# EAGLE design R212X (EAGLE 6.6.0)
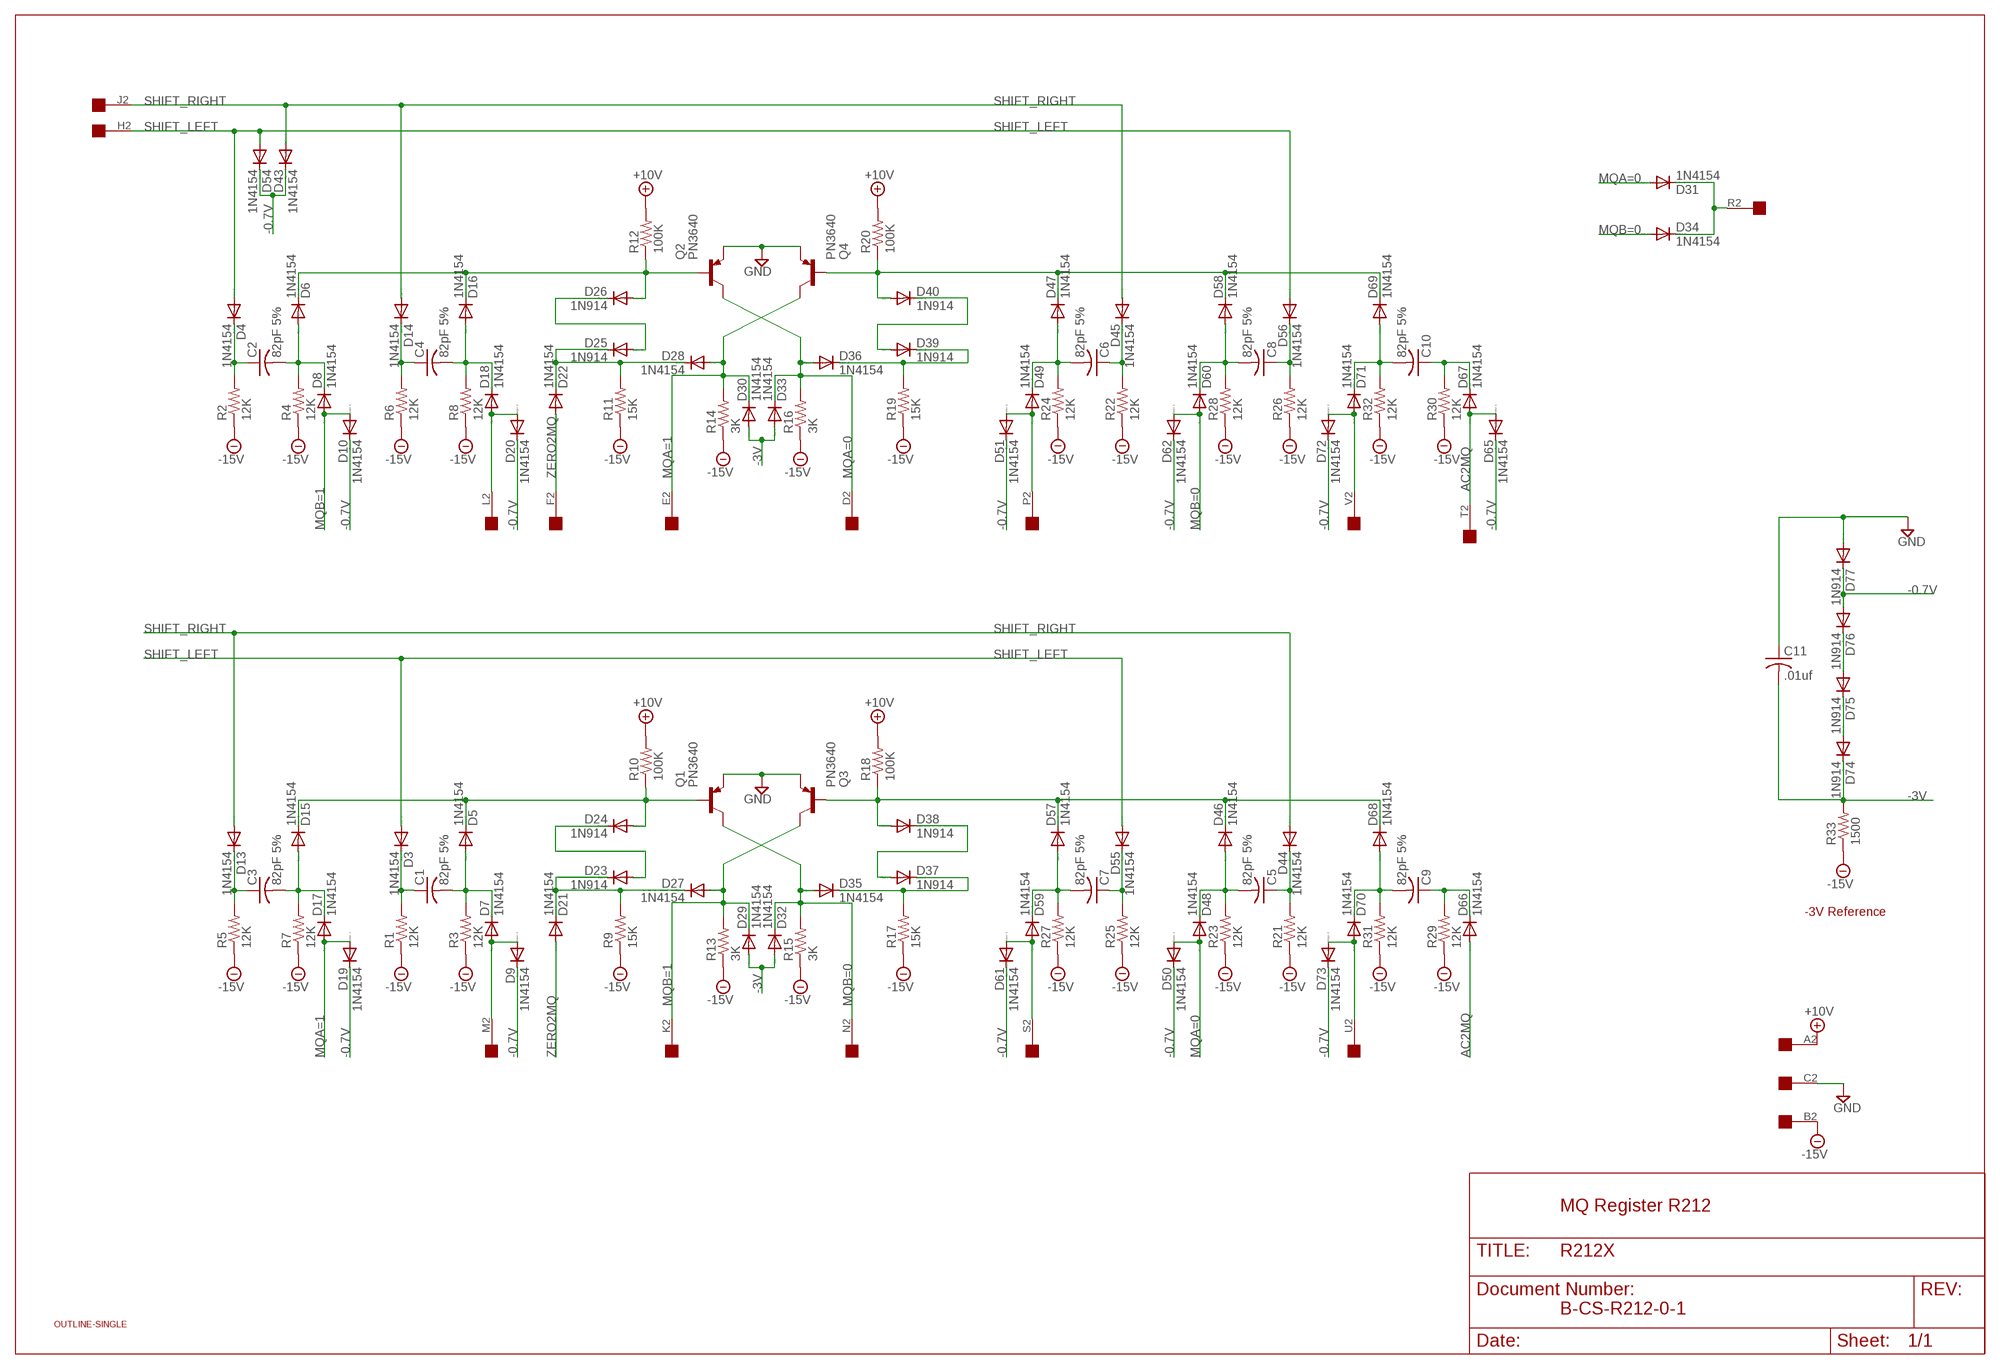
[diagram p0: schematic, sheet 1]

## Parts
C1  82pF 5%  C-US050-025X075  [C050-025X075]
C2  82pF 5%  C-US050-025X075  [C050-025X075]
C3  82pF 5%  C-US050-025X075  [C050-025X075]
C4  82pF 5%  C-US050-025X075  [C050-025X075]
C5  82pF 5%  C-US050-025X075  [C050-025X075]
C6  82pF 5%  C-US050-025X075  [C050-025X075]
C7  82pF 5%  C-US050-025X075  [C050-025X075]
C8  82pF 5%  C-US050-025X075  [C050-025X075]
C9  82pF 5%  C-US050-025X075  [C050-025X075]
C10  82pF 5%  C-US050-025X075  [C050-025X075]
C11  .01uf  C-US050-025X075  [C050-025X075]
D3  1N4154  1N4148DO35-10  [DO35-10]
D4  1N4154  1N4148DO35-10  [DO35-10]
D5  1N4154  1N4148DO35-10  [DO35-10]
D6  1N4154  1N4148DO35-10  [DO35-10]
D7  1N4154  1N4148DO35-10  [DO35-10]
D8  1N4154  1N4148DO35-10  [DO35-10]
D9  1N4154  1N4148DO35-10  [DO35-10]
D10  1N4154  1N4148DO35-10  [DO35-10]
D13  1N4154  1N4148DO35-10  [DO35-10]
D14  1N4154  1N4148DO35-10  [DO35-10]
D15  1N4154  1N4148DO35-10  [DO35-10]
D16  1N4154  1N4148DO35-10  [DO35-10]
D17  1N4154  1N4148DO35-10  [DO35-10]
D18  1N4154  1N4148DO35-10  [DO35-10]
D19  1N4154  1N4148DO35-10  [DO35-10]
D20  1N4154  1N4148DO35-10  [DO35-10]
D21  1N4154  1N4148DO35-10  [DO35-10]
D22  1N4154  1N4148DO35-10  [DO35-10]
D23  1N914  1N4148DO35-10  [DO35-10]
D24  1N914  1N4148DO35-10  [DO35-10]
D25  1N914  1N4148DO35-10  [DO35-10]
D26  1N914  1N4148DO35-10  [DO35-10]
D27  1N4154  1N4148DO35-10  [DO35-10]
D28  1N4154  1N4148DO35-10  [DO35-10]
D29  1N4154  1N4148DO35-10  [DO35-10]
D30  1N4154  1N4148DO35-10  [DO35-10]
D31  1N4154  1N4148DO35-10  [DO35-10]
D32  1N4154  1N4148DO35-10  [DO35-10]
D33  1N4154  1N4148DO35-10  [DO35-10]
D34  1N4154  1N4148DO35-10  [DO35-10]
D35  1N4154  1N4148DO35-10  [DO35-10]
D36  1N4154  1N4148DO35-10  [DO35-10]
D37  1N914  1N4148DO35-10  [DO35-10]
D38  1N914  1N4148DO35-10  [DO35-10]
D39  1N914  1N4148DO35-10  [DO35-10]
D40  1N914  1N4148DO35-10  [DO35-10]
D43  1N4154  1N4148DO35-10  [DO35-10]
D44  1N4154  1N4148DO35-10  [DO35-10]
D45  1N4154  1N4148DO35-10  [DO35-10]
D46  1N4154  1N4148DO35-10  [DO35-10]
D47  1N4154  1N4148DO35-10  [DO35-10]
D48  1N4154  1N4148DO35-10  [DO35-10]
D49  1N4154  1N4148DO35-10  [DO35-10]
D50  1N4154  1N4148DO35-10  [DO35-10]
D51  1N4154  1N4148DO35-10  [DO35-10]
D54  1N4154  1N4148DO35-10  [DO35-10]
D55  1N4154  1N4148DO35-10  [DO35-10]
D56  1N4154  1N4148DO35-10  [DO35-10]
D57  1N4154  1N4148DO35-10  [DO35-10]
D58  1N4154  1N4148DO35-10  [DO35-10]
D59  1N4154  1N4148DO35-10  [DO35-10]
D60  1N4154  1N4148DO35-10  [DO35-10]
D61  1N4154  1N4148DO35-10  [DO35-10]
D62  1N4154  1N4148DO35-10  [DO35-10]
D65  1N4154  1N4148DO35-10  [DO35-10]
D66  1N4154  1N4148DO35-10  [DO35-10]
D67  1N4154  1N4148DO35-10  [DO35-10]
D68  1N4154  1N4148DO35-10  [DO35-10]
D69  1N4154  1N4148DO35-10  [DO35-10]
D70  1N4154  1N4148DO35-10  [DO35-10]
D71  1N4154  1N4148DO35-10  [DO35-10]
D72  1N4154  1N4148DO35-10  [DO35-10]
D73  1N4154  1N4148DO35-10  [DO35-10]
D74  1N914  1N4148DO35-10  [DO35-10]
D75  1N914  1N4148DO35-10  [DO35-10]
D76  1N914  1N4148DO35-10  [DO35-10]
D77  1N914  1N4148DO35-10  [DO35-10]
Q1  PN3640  2N3637  [TO39]
Q2  PN3640  2N3637  [TO39]
Q3  PN3640  2N3637  [TO39]
Q4  PN3640  2N3637  [TO39]
R1  12K  R-US_0207/10  [0207/10]
R2  12K  R-US_0207/10  [0207/10]
R3  12K  R-US_0207/10  [0207/10]
R4  12K  R-US_0207/10  [0207/10]
R5  12K  R-US_0207/10  [0207/10]
R6  12K  R-US_0207/10  [0207/10]
R7  12K  R-US_0207/10  [0207/10]
R8  12K  R-US_0207/10  [0207/10]
R9  15K  R-US_0207/10  [0207/10]
R10  100K  R-US_0207/10  [0207/10]
R11  15K  R-US_0207/10  [0207/10]
R12  100K  R-US_0207/10  [0207/10]
R13  3K  R-US_0207/10  [0207/10]
R14  3K  R-US_0207/10  [0207/10]
R15  3K  R-US_0207/10  [0207/10]
R16  3K  R-US_0207/10  [0207/10]
R17  15K  R-US_0207/10  [0207/10]
R18  100K  R-US_0207/10  [0207/10]
R19  15K  R-US_0207/10  [0207/10]
R20  100K  R-US_0207/10  [0207/10]
R21  12K  R-US_0207/10  [0207/10]
R22  12K  R-US_0207/10  [0207/10]
R23  12K  R-US_0207/10  [0207/10]
R24  12K  R-US_0207/10  [0207/10]
R25  12K  R-US_0207/10  [0207/10]
R26  12K  R-US_0207/10  [0207/10]
R27  12K  R-US_0207/10  [0207/10]
R28  12K  R-US_0207/10  [0207/10]
R29  12K  R-US_0207/10  [0207/10]
R30  12K  R-US_0207/10  [0207/10]
R31  12K  R-US_0207/10  [0207/10]
R32  12K  R-US_0207/10  [0207/10]
R33  1500  R-US_0207/10  [0207/10]
U$1  OUTLINE-SINGLE  [SINGLE]
U$2  EDGE-1  [EDGE-CON1]

## Nets
+10V [Power]: R10.2 R12.2 R18.2 R20.2 U$2.A2
-0.7V: D9.C D10.C D19.C D20.C D43.C D50.C D51.C D54.C D61.C D62.C D65.C D72.C D73.C D76.A D77.C
-3V [Power]: C11.2 D29.A D30.A D32.A D33.A D74.C R33.2
-15V [Power]: R1.1 R2.1 R3.1 R4.1 R5.1 R6.1 R7.1 R8.1 R9.1 R11.1 R13.1 R14.1 R15.1 R16.1 R17.1 R19.1 R21.1 R22.1 R23.1 R24.1 R25.1 R26.1 R27.1 R28.1 R29.1 R30.1 R31.1 R32.1 R33.1 U$2.B2
AC2MQ: D65.A D66.A D67.A U$2.T2
GND [Power]: C11.1 D77.A Q1.1(E) Q2.1(E) Q3.1(E) Q4.1(E) U$2.C2
MQA=0: D31.A D33.C D36.A D48.A D50.A Q2.3(C) R16.2 U$2.D2
MQA=1: D17.A D19.A D28.A D30.C Q4.3(C) R14.2 U$2.E2
MQB=0: D32.C D34.A D35.A D60.A D62.A Q1.3(C) R15.2 U$2.N2
MQB=1: D8.A D10.A D27.A D29.C Q3.3(C) R13.2 U$2.K2
N$1: D6.C D16.C D26.A Q2.2(B) R12.1
N$2: C2.1 D4.C R2.2
N$3: C2.2 D6.A D8.C R4.2
N$4: C10.1 D67.C R30.2
N$5: C4.1 D14.C R6.2
N$6: C4.2 D16.A D18.C R8.2
N$7: D18.A D20.A U$2.L2
N$8: D22.C D25.C D28.C R11.2
N$9: D25.A D26.C
N$10: C10.2 D69.A D71.C R32.2
N$11: D71.A D72.A U$2.V2
N$12: D40.A D47.C D58.C D69.C Q4.2(B) R20.1
N$13: D75.A D76.C
N$14: D31.C D34.C U$2.R2
N$15: C8.1 D56.C R26.2
N$16: D74.A D75.C
N$17: C8.2 D58.A D60.C R28.2
N$18: D5.C D15.C D24.A Q1.2(B) R10.1
N$19: C6.1 D45.C R22.2
N$20: C6.2 D47.A D49.C R24.2
N$21: D49.A D51.A U$2.P2
N$22: D36.C D39.C R19.2
N$23: D39.A D40.C
N$24: C3.1 D13.C R5.2
N$25: C3.2 D15.A D17.C R7.2
N$26: C1.1 D3.C R1.2
N$27: C1.2 D5.A D7.C R3.2
N$28: D7.A D9.A U$2.M2
N$29: D21.C D23.C D27.C R9.2
N$30: D23.A D24.C
N$31: C5.1 D44.C R21.2
N$32: C5.2 D46.A D48.C R23.2
N$33: C7.1 D55.C R25.2
N$34: C7.2 D57.A D59.C R27.2
N$35: D59.A D61.A U$2.S2
N$36: D35.C D37.C R17.2
N$37: D37.A D38.C
N$38: D38.A D46.C D57.C D68.C Q3.2(B) R18.1
N$39: C9.1 D66.C R29.2
N$40: C9.2 D68.A D70.C R31.2
N$41: D70.A D73.A U$2.U2
SHIFT_LEFT: D3.A D4.A D54.A D55.A D56.A U$2.H2
SHIFT_RIGHT: D13.A D14.A D43.A D44.A D45.A U$2.J2
ZERO2MQ: D21.A D22.A U$2.F2

## Notes on the sheet
- -3V Reference
- MQ Register R212
- B-CS-R212-0-1

## Library data of the parts
C1-C11 = rcl:C-US: CAPACITOR, American symbol
D3-D10 D13-D40 D43-D51 D54-D62 D65-D77 = diode:1N4148: DIODE high speed (Philips)
Q1-Q4 = transistor-pnp:2N3637*: PNP Transistror
R1-R33 = rcl:R-US_: RESISTOR, American symbol
U$1 = dec-con:OUTLINE-*: Board outlines for DEC boards.
U$2 = dec-con:EDGE-1: Single-Sided DEC Edge Connector -- (side 2)

## Net classes
1 Power: width 0.813 mm

## Board
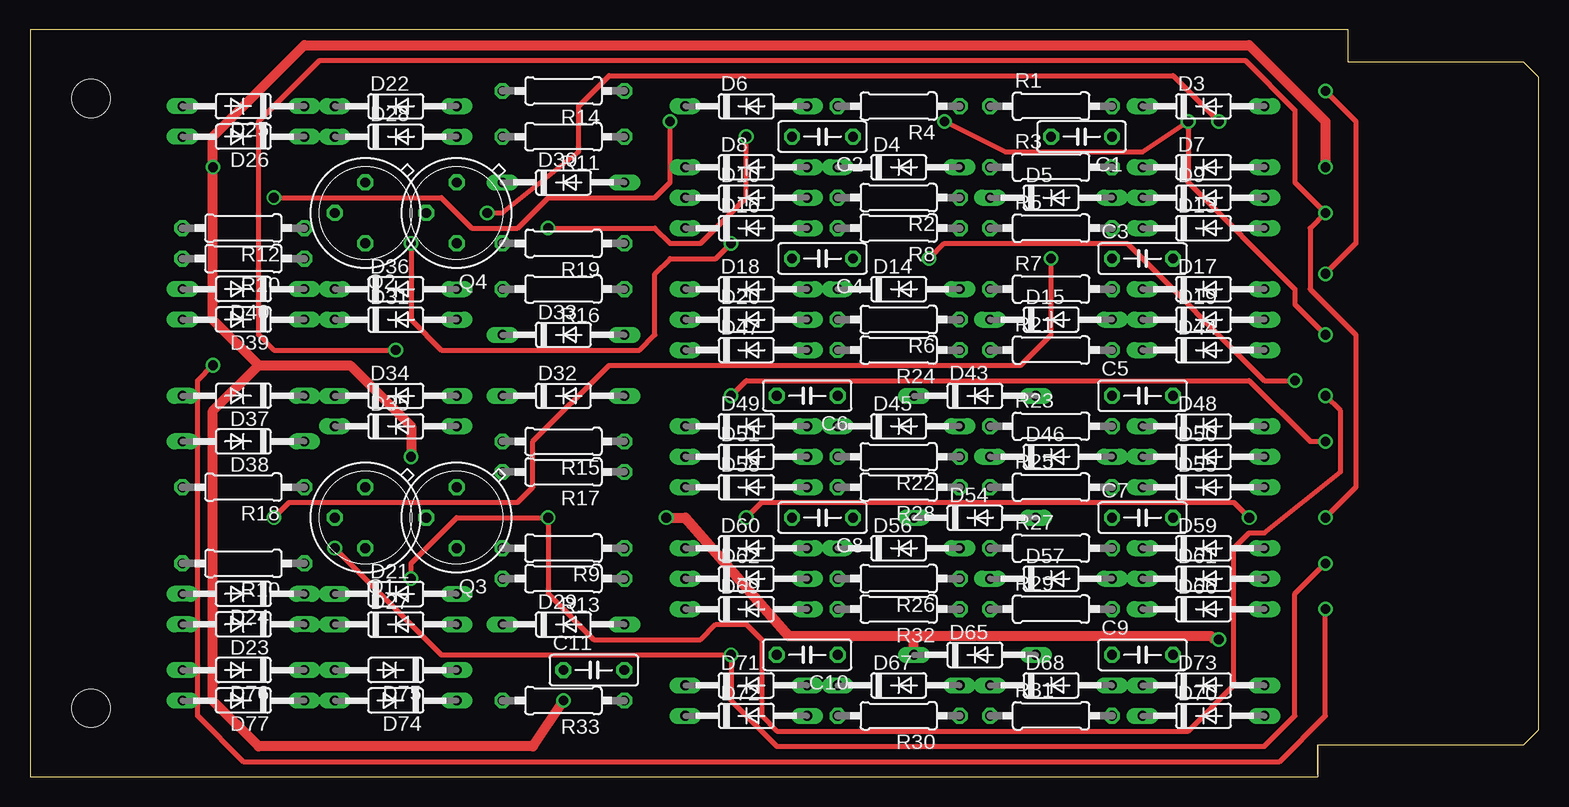
[diagram p1: board, top side]
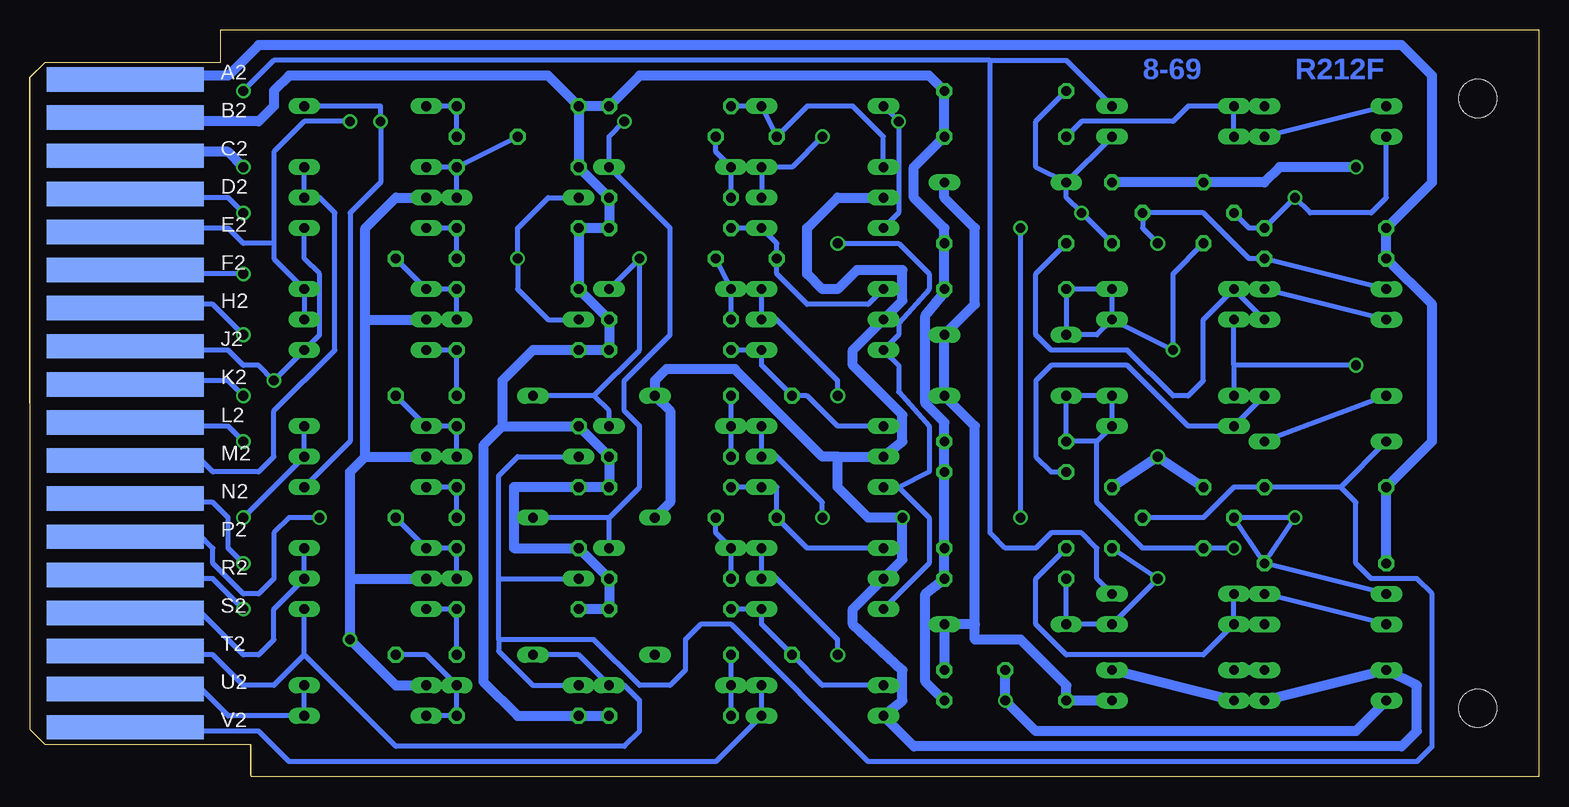
[diagram p2: board, bottom side, seen from below]

Size 125.73 x 62.23 mm. Coordinates in mm from the lower left corner, seen from the top.
Copper layers (1*16): Top 0.035mm / dielectric 1.5mm / Bottom 0.035mm
Design rules "15mils": minimum track width 15mil, minimum drill 24mil, track to track 15mil, track to pad 10mil, pad to pad 10mil, via to via 10mil, smd to smd 10mil, copper to edge 13mil, drill to drill 10mil, minimum pad ring 10mil, minimum via ring 8mil, stop-mask expansion 0mil, vias tented up to drill 0mil, thermal gap 10mil

### Footprints (pad centres in the part's own frame; a part is rotated, then mirrored left to right if it is on the bottom)
C050-025X075 = drill 0.813 octagon: 1 -2.54,0; 2 2.54,0
DO35-10 = drill 0.813 long: A 5.08,0; C -5.08,0
TO39 = drill 0.813 octagon: 1 0,-2.54; 2 2.54,0; 3 0,2.54
0207/10 = drill 0.813 octagon: 1 -5.08,0; 2 5.08,0
SINGLE = hole 3.175: 120.65,56.515; 120.65,5.715
EDGE-CON1 = smd 13.106 x 2.032 bottom: A2 7.938,4.128; B2 7.938,7.303; C2 7.938,10.477; D2 7.938,13.652; E2 7.938,16.828; F2 7.938,20.003; H2 7.938,23.177; J2 7.938,26.352; K2 7.938,29.527; L2 7.938,32.703; M2 7.938,35.877; N2 7.938,39.053; P2 7.938,42.227; R2 7.938,45.403; S2 7.938,48.578; T2 7.938,51.752; U2 7.938,54.928; V2 7.938,58.102

### Placement (x,y rotation side)
C1  87.63,53.34 180 top
C2  66.04,53.34 180 top
C3  92.71,43.18 0 top
C4  66.04,43.18 180 top
C5  92.71,31.75 0 top
C6  64.77,31.75 180 top
C7  92.71,21.59 0 top
C8  66.04,21.59 180 top
C9  92.71,10.16 0 top
C10  64.77,10.16 180 top
C11  46.99,8.89 0 top
D3  97.79,55.88 0 top
D4  72.39,50.8 0 top
D5  85.09,48.26 0 top
D6  59.69,55.88 0 top
D7  97.79,50.8 0 top
D8  59.69,50.8 0 top
D9  97.79,48.26 0 top
D10  59.69,48.26 0 top
D13  97.79,45.72 0 top
D14  72.39,40.64 0 top
D15  85.09,38.1 0 top
D16  59.69,45.72 0 top
D17  97.79,40.64 0 top
D18  59.69,40.64 0 top
D19  97.79,38.1 0 top
D20  59.69,38.1 0 top
D21  30.48,15.24 0 top
D22  30.48,55.88 0 top
D23  17.78,12.7 180 top
D24  17.78,15.24 180 top
D25  17.78,55.88 180 top
D26  17.78,53.34 180 top
D27  30.48,12.7 0 top
D28  30.48,53.34 0 top
D29  44.45,12.7 0 top
D30  44.45,49.53 0 top
D31  30.48,38.1 0 top
D32  44.45,31.75 0 top
D33  44.45,36.83 0 top
D34  30.48,31.75 0 top
D35  30.48,29.21 0 top
D36  30.48,40.64 0 top
D37  17.78,31.75 180 top
D38  17.78,27.94 180 top
D39  17.78,38.1 180 top
D40  17.78,40.64 180 top
D43  78.74,31.75 0 top
D44  97.79,35.56 0 top
D45  72.39,29.21 0 top
D46  85.09,26.67 0 top
D47  59.69,35.56 0 top
D48  97.79,29.21 0 top
D49  59.69,29.21 0 top
D50  97.79,26.67 0 top
D51  59.69,26.67 0 top
D54  78.74,21.59 0 top
D55  97.79,24.13 0 top
D56  72.39,19.05 0 top
D57  85.09,16.51 0 top
D58  59.69,24.13 0 top
D59  97.79,19.05 0 top
D60  59.69,19.05 0 top
D61  97.79,16.51 0 top
D62  59.69,16.51 0 top
D65  78.74,10.16 0 top
D66  97.79,13.97 0 top
D67  72.39,7.62 0 top
D68  85.09,7.62 0 top
D69  59.69,13.97 0 top
D70  97.79,5.08 0 top
D71  59.69,7.62 0 top
D72  59.69,5.08 0 top
D73  97.79,7.62 0 top
D74  30.48,6.35 180 top
D75  30.48,8.89 180 top
D76  17.78,8.89 180 top
D77  17.78,6.35 180 top
Q1  27.94,21.59 180 top
Q2  27.94,46.99 180 top
Q3  35.56,21.59 180 top
Q4  35.56,46.99 180 top
R1  85.09,55.88 0 top
R2  72.39,48.26 180 top
R3  85.09,50.8 0 top
R4  72.39,55.88 180 top
R5  85.09,45.72 0 top
R6  72.39,38.1 180 top
R7  85.09,40.64 0 top
R8  72.39,45.72 180 top
R9  44.45,19.05 180 top
R10  17.78,17.78 180 top
R11  44.45,53.34 180 top
R12  17.78,45.72 180 top
R13  44.45,16.51 180 top
R14  44.45,57.15 180 top
R15  44.45,27.94 180 top
R16  44.45,40.64 180 top
R17  44.45,25.4 180 top
R18  17.78,24.13 180 top
R19  44.45,44.45 180 top
R20  17.78,43.18 180 top
R21  85.09,35.56 0 top
R22  72.39,26.67 180 top
R23  85.09,29.21 0 top
R24  72.39,35.56 180 top
R25  85.09,24.13 0 top
R26  72.39,16.51 180 top
R27  85.09,19.05 0 top
R28  72.39,24.13 180 top
R29  85.09,13.97 0 top
R30  72.39,5.08 180 top
R31  85.09,5.08 0 top
R32  72.39,13.97 180 top
R33  44.45,6.35 180 top
U$1  125.73,62.23 180 top
U$2  125.73,62.23 180 top

### Tracks (layer width: path | path; a pad name or v marks a point on that pad's centre or on a via)
+10V
  Bottom 0.813: U$2.A2 116.84,58.04 116.84,58.42 109.22,58.42 106.68,60.96 11.43,60.96 8.89,58.42 8.89,49.53 R12.2 R20.2 8.89,39.37 8.89,27.94 R18.2 R10.2
-0.7V  (via drill 0.81)
  Top 0.813: v99.06,11.43 98.74,11.43 98.42,11.75 79.06,11.75 78.74,11.75 73.66,11.75 | v53.02,21.59 54.61,21.59 63.18,11.75 73.66,11.75 | D65.C 73.66,11.75
  Bottom 0.813: D73.C 95.25,7.62 v99.06,11.43 99.06,16.51 | 99.06,16.51 D61.C | 99.06,16.51 99.06,25.4 97.79,26.67 | 97.79,26.67 D50.C | 97.79,26.67 97.79,38.1 | 97.79,38.1 D19.C | 97.79,38.1 97.79,45.72 95.25,48.26 D9.C | D77.C D76.A 10.16,7.62 10.16,3.81 11.43,2.54 52.07,2.54 D72.C 53.02,6.35 53.02,8.89 57.15,12.7 57.15,13.97 D62.C 53.02,18.1 v53.02,21.59 55.88,21.59 58.42,24.13 58.42,26.67 | D54.C 72.39,22.86 72.39,30.48 D43.C 73.66,33.02 72.71,33.97 66.99,33.97 59.69,26.67 58.42,26.67 | 58.42,26.67 D51.C 53.02,27.94 53.02,30.16 57.15,34.29 57.15,35.56 D20.C 53.02,39.69 53.02,42.23 56.83,42.23 58.42,40.64 59.69,40.64 60.96,41.91 60.96,45.72 58.42,48.26 D10.C
-3V
  Bottom 0.813: 46.99,12.7 D29.A C11.2 | 46.99,12.7 46.99,11.43 43.18,11.43 39.37,7.62 R33.2 D74.C | 46.99,12.7 46.99,29.21 D32.A D33.A 46.99,39.37 46.99,45.72 49.53,48.26 D30.A
-15V
  Bottom 0.813: U$2.B2 118.06,54.66 118.11,54.61 106.68,54.61 105.41,55.88 105.41,57.15 104.14,58.42 82.55,58.42 R1.1 | R1.1 R4.1 74.93,58.42 50.8,58.42 R14.1 R11.1 52.07,50.8 52.07,48.26 49.53,45.72 R19.1 R16.1 49.53,40.32 51.12,38.42 51.12,31.11 49.53,29.53 R15.1 R17.1 R9.1 R13.1 51.12,15.24 51.12,7.94 R33.1 | R30.1 R31.1 85.09,5.08 87.95,7.94 87.95,27.62 86.36,29.21 | R29.1 R32.1 R26.1 R27.1 85.41,19.05 85.41,24.13 R25.1 R28.1 R22.1 R23.1 86.36,29.21 | 86.36,29.21 86.36,33.02 83.82,35.56 R21.1 R24.1 R6.1 R7.1 R5.1 R8.1 R2.1 R3.1 R1.1
AC2MQ
  Bottom 0.406: U$2.T2 117.17,10.49 116.84,10.16 110.49,10.16 107.95,7.62 105.41,7.62 102.87,10.16 | 102.87,10.16 95.25,2.54 76.2,2.54 74.93,3.81 74.93,6.35 76.2,7.62 D67.A 80.01,10.16 D65.A | 102.87,10.16 D66.A
GND  (via drill 0.81)
  Top 0.813: v107.95,50.8 107.95,54.61 101.6,60.96 22.86,60.96 15.24,53.34 v15.24,50.8 15.24,38.1 19.05,34.29 | v31.75,26.67 31.75,29.21 26.67,34.29 19.05,34.29 | v44.45,6.35 41.91,2.54 19.05,2.54 15.24,6.35 15.24,30.48 19.05,34.29
  Bottom 0.813: U$2.C2 117.17,51.74 116.84,52.07 109.22,52.07 v107.95,50.8 | C11.1 v44.45,6.35 41.91,3.81 15.24,3.81 D77.A | v15.24,50.8 21.59,50.8 22.86,49.53 Q2.1 Q4.1 | Q1.1 v31.75,26.67 Q3.1
MQA=0  (via drill 0.81)
  Top 0.406: v107.95,21.59 110.49,24.13 110.49,36.83 106.68,40.64 106.68,45.72 v107.95,46.99 105.41,49.53 105.41,55.56 101.28,59.69 24.13,59.69 19.05,54.61 19.05,36.83 20.32,35.56 v30.48,35.56
  Bottom 0.406: U$2.D2 117.14,48.56 116.84,48.26 109.22,48.26 v107.95,46.99 | v107.95,21.59 D50.A D48.A | Q2.3 30.48,41.91 v30.48,35.56 D31.A | D31.A 36.83,36.83 D33.C R16.2 D36.A D31.A
MQA=1  (via drill 0.81)
  Top 0.406: v99.06,54.61 95.25,58.42 48.26,58.42 45.72,55.88 45.72,52.07 39.37,46.99 v38.1,46.99
  Bottom 0.406: U$2.E2 117.17,45.39 116.84,45.72 109.22,45.72 107.95,44.45 105.41,44.45 | 105.41,44.45 105.41,43.18 D17.A D19.A | 105.41,44.45 105.41,52.07 102.87,54.61 v99.06,54.61 | Q4.3 v38.1,46.99 39.37,48.26 D30.C | D30.C 41.91,50.8 41.91,54.61 R14.2 | D30.C D28.A
MQB=0  (via drill 0.81)
  Top 0.406: v107.95,17.78 105.41,15.24 105.41,5.08 102.87,2.54 62.23,2.54 58.42,6.35 v58.42,10.16 34.29,10.16 v25.4,19.05
  Bottom 0.406: U$2.N2 117.17,23.19 116.84,22.86 110.49,22.86 109.22,21.59 109.22,19.05 v107.95,17.78 | v25.4,19.05 Q1.3 33.02,19.05 36.83,22.86 36.83,27.94 | 36.83,27.94 R15.2 D32.C D34.A D35.A 36.83,27.94 | v58.42,10.16 58.42,11.43 63.5,16.51 D62.A D60.A
MQB=1  (via drill 0.81)
  Top 0.406: v107.95,31.75 109.22,30.48 109.22,25.4 102.87,20.32 101.6,20.32 100.33,19.05 100.33,7.62 96.52,3.81 62.23,3.81 60.96,5.08 60.96,11.43 59.69,12.7 57.15,12.7 55.88,11.43 46.99,11.43 43.18,15.24 v43.18,21.59 35.56,21.59 31.75,17.78 v31.75,16.51 | v43.18,45.72 52.07,45.72 53.34,44.45 55.88,44.45 59.69,48.26 v59.69,53.34
  Bottom 0.406: U$2.K2 117.14,32.72 116.84,33.02 109.22,33.02 v107.95,31.75 | Q3.3 v31.75,16.51 D27.A D29.C R13.2 | v43.18,21.59 v43.18,45.72 | D10.A D8.A 62.23,50.8 v59.69,53.34
N$1  (via drill 0.81)
  Top 0.406: v20.32,48.26 34.29,48.26 36.83,45.72 40.64,45.72 43.18,48.26 52.07,48.26 53.34,49.53 v53.34,54.61
  Bottom 0.406: Q2.2 24.13,45.72 R12.1 v20.32,48.26 19.05,46.99 13.97,46.99 12.7,48.26 D26.A | D16.C 53.34,46.99 v53.34,54.61 D6.C
N$2
  Bottom 0.406: C2.1 68.58,52.07 D4.C R2.2
N$3
  Bottom 0.406: D8.C 54.61,53.34 57.15,55.88 60.96,55.88 C2.2 D6.A R4.2
N$4
  Bottom 0.406: R30.2 D67.C C10.1
N$5
  Bottom 0.406: C4.1 D14.C R6.2
N$6
  Bottom 0.406: D18.C 55.88,39.37 60.96,39.37 63.5,41.91 C4.2 63.5,44.45 D16.A R8.2
N$7  (via drill 0.81)
  Top 0.406: v107.95,27.94 106.68,27.94 101.6,33.02 59.69,33.02 v58.42,31.75
  Bottom 0.406: U$2.L2 117.17,29.54 116.84,29.21 109.22,29.21 v107.95,27.94 | v58.42,31.75 58.42,33.02 63.5,38.1 D20.A D18.A
N$8
  Bottom 0.406: R11.2 38.1,54.61 30.48,54.61 29.21,55.88 D22.C | D28.C D22.C | D22.C D25.C
N$9
  Bottom 0.406: D25.A D26.C
N$10
  Bottom 0.406: D71.C 59.69,7.62 C10.2 64.77,12.7 D69.A R32.2
N$11
  Bottom 0.406: U$2.V2 118.06,3.86 118.11,3.81 106.68,3.81 104.14,1.27 68.58,1.27 D72.A D71.A
N$12  (via drill 0.81)
  Top 0.406: v31.75,44.45 31.75,38.1 34.29,35.56 50.8,35.56 52.07,36.83 52.07,41.91 53.34,43.18 57.15,43.18 v58.42,44.45
  Bottom 0.406: D40.A R20.1 24.13,43.18 27.94,46.99 Q4.2 33.02,45.72 v31.75,44.45 | D69.C 50.8,17.78 50.8,21.59 53.34,24.13 | 53.34,24.13 D58.C | 53.34,24.13 50.8,25.4 50.8,29.21 53.34,32.07 53.34,34.29 D47.C 53.34,36.83 53.34,37.78 50.8,40.64 50.8,41.91 53.34,44.45 v58.42,44.45
N$13
  Bottom 0.813: D76.C D75.A
N$14  (via drill 0.81)
  Top 0.406: v107.95,13.97 107.95,5.08 104.14,1.27 17.78,1.27 13.97,5.08 13.97,33.02 v15.24,34.29
  Bottom 0.406: U$2.R2 117.17,16.84 116.84,16.51 110.49,16.51 v107.95,13.97 | v15.24,34.29 25.4,34.29 | 25.4,34.29 D34.C | 25.4,34.29 D31.C
N$15
  Bottom 0.406: C8.1 68.58,20.32 D56.C R26.2
N$16
  Bottom 0.813: D74.A D75.C
N$17
  Bottom 0.406: R28.2 D58.A 63.5,24.13 C8.2 60.96,19.05 D60.C
N$18  (via drill 0.81)
  Top 0.406: v20.32,21.59 21.59,22.86 40.64,22.86 41.91,24.13 41.91,27.94 48.26,34.29 82.55,34.29 85.09,36.83 v85.09,43.18
  Bottom 0.406: R10.1 v20.32,21.59 Q1.2 R10.1 | D15.C 82.55,38.1 85.09,40.64 v85.09,43.18 85.09,45.72 82.55,48.26 D5.C | D24.A R10.1
N$19
  Bottom 0.406: R22.2 D45.C C6.1
N$20
  Bottom 0.406: D49.C 58.42,29.21 60.96,31.75 C6.2 64.77,34.29 D47.A R24.2
N$21  (via drill 0.81)
  Top 0.406: v101.6,21.59 100.33,22.86 60.96,22.86 v59.69,21.59
  Bottom 0.406: U$2.P2 117.17,19.99 116.84,20.32 111.76,20.32 110.49,19.05 110.49,17.78 107.95,15.24 106.68,15.24 105.41,16.51 105.41,20.32 104.14,21.59 v101.6,21.59 | v59.69,21.59 59.69,22.86 63.5,26.67 D51.A D49.A
N$22
  Bottom 0.406: D39.C D36.C 27.94,38.1 27.94,33.02 29.21,31.75 30.48,31.75 34.29,35.56 40.64,35.56 41.91,36.83 41.91,41.91 R19.2
N$23
  Bottom 0.406: D39.A D40.C
N$24
  Bottom 0.406: C3.1 R5.2 D13.C
N$25
  Bottom 0.406: D15.A R7.2 D17.C C3.2
N$26
  Bottom 0.406: C1.1 R1.2 D3.C
N$27
  Bottom 0.406: D5.A R3.2 | R3.2 C1.2 | R3.2 D7.C
N$28
  Bottom 0.406: U$2.M2 117.17,26.34 116.84,26.67 111.76,26.67 110.49,25.4 106.68,25.4 105.41,26.67 105.41,30.48 100.33,35.56 100.33,46.99 101.6,48.26 D9.A D7.A
N$29
  Bottom 0.406: D23.C D27.C | D27.C D21.C | D27.C 27.94,10.16 39.37,10.16 41.91,12.7 41.91,16.51 R9.2
N$30
  Bottom 0.406: D23.A D24.C
N$31
  Bottom 0.406: C5.1 R21.2 D44.C
N$32
  Bottom 0.406: D46.A R23.2 D48.C C5.2
N$33
  Bottom 0.406: C7.1 R25.2 D55.C
N$34
  Bottom 0.406: C7.2 D59.C R27.2 D57.A
N$35
  Bottom 0.406: U$2.S2 117.14,13.66 116.84,13.97 111.76,13.97 107.95,10.16 106.68,10.16 105.41,11.43 105.41,13.97 D61.A D59.A
N$36
  Bottom 0.406: D37.C D35.C 29.21,29.21 34.29,34.29 40.64,34.29 41.91,33.02 41.91,26.67 40.64,25.4 R17.2
N$37
  Bottom 0.406: D37.A D38.C
N$38
  Bottom 0.406: D68.C 83.82,7.62 86.68,10.48 86.68,11.43 | 86.68,11.43 86.68,16.51 | 86.68,16.51 86.68,25.08 85.09,26.67 D46.C | 86.68,16.51 D57.C | 86.68,11.43 78.74,11.43 74.93,7.62 72.39,7.62 71.12,8.89 71.12,11.43 69.85,12.7 67.31,12.7 55.88,1.27 10.16,1.27 8.89,2.54 8.89,15.24 10.16,16.51 13.97,16.51 15.24,17.78 15.24,22.86 16.51,24.13 | Q3.2 27.94,21.59 25.4,24.13 R18.1 16.51,24.13 | 16.51,24.13 D38.A
N$39
  Bottom 0.406: C9.1 R29.2 D66.C
N$40
  Bottom 0.406: D70.C R31.2 D68.A 92.71,10.16 C9.2
N$41
  Bottom 0.406: U$2.U2 117.2,7.26 116.84,7.62 111.76,7.62 109.22,5.08 D70.A D73.A
SHIFT_LEFT  (via drill 0.81)
  Top 0.406: v107.95,36.83 105.41,39.37 105.41,40.64 96.52,49.53 v96.52,54.61 92.71,52.07 81.28,52.07 v76.2,54.61
  Bottom 0.406: U$2.H2 117.17,39.04 116.84,39.37 110.49,39.37 v107.95,36.83 | D3.A 96.52,55.88 v96.52,54.61 96.52,49.53 99.06,46.99 99.06,27.94 D55.A | v76.2,54.61 77.47,53.34 D4.A 72.39,45.72 72.39,36.83 76.2,33.02 76.2,30.48 74.93,29.21 74.93,24.13 77.47,21.59 | D56.A 77.47,21.59 | 77.47,21.59 D54.A
SHIFT_RIGHT  (via drill 0.81)
  Top 0.406: v105.41,33.02 102.87,33.02 91.44,44.45 76.2,44.45 v74.93,43.18
  Bottom 0.406: U$2.J2 115.9,35.89 115.57,35.56 109.22,35.56 107.95,34.29 106.68,34.29 v105.41,33.02 D44.A 101.6,36.83 101.6,41.91 102.87,43.18 D13.A | 78.74,31.75 74.93,35.56 v74.93,43.18 D14.A | 78.74,31.75 D43.A | D45.A 77.47,30.48 78.74,31.75
ZERO2MQ  (via drill 0.81)
  Top 0.406: v107.95,41.91 110.49,44.45 110.49,54.61 v107.95,57.15
  Bottom 0.406: U$2.F2 118.09,41.93 118.11,41.91 v107.95,41.91 | v107.95,57.15 105.41,59.69 45.72,59.69 | 45.72,59.69 39.37,59.69 D22.A | 45.72,59.69 45.72,20.32 44.45,19.05 41.91,19.05 40.64,20.32 38.1,20.32 36.83,19.05 36.83,16.51 D21.A

### Text on the board
Bottom: R212F | 8-69
200bmp: C:/Users/Vince/Documents/websvn/trunk/Eagle/projects/DEC/Rxxx/R212/R212Fbackb.bmp